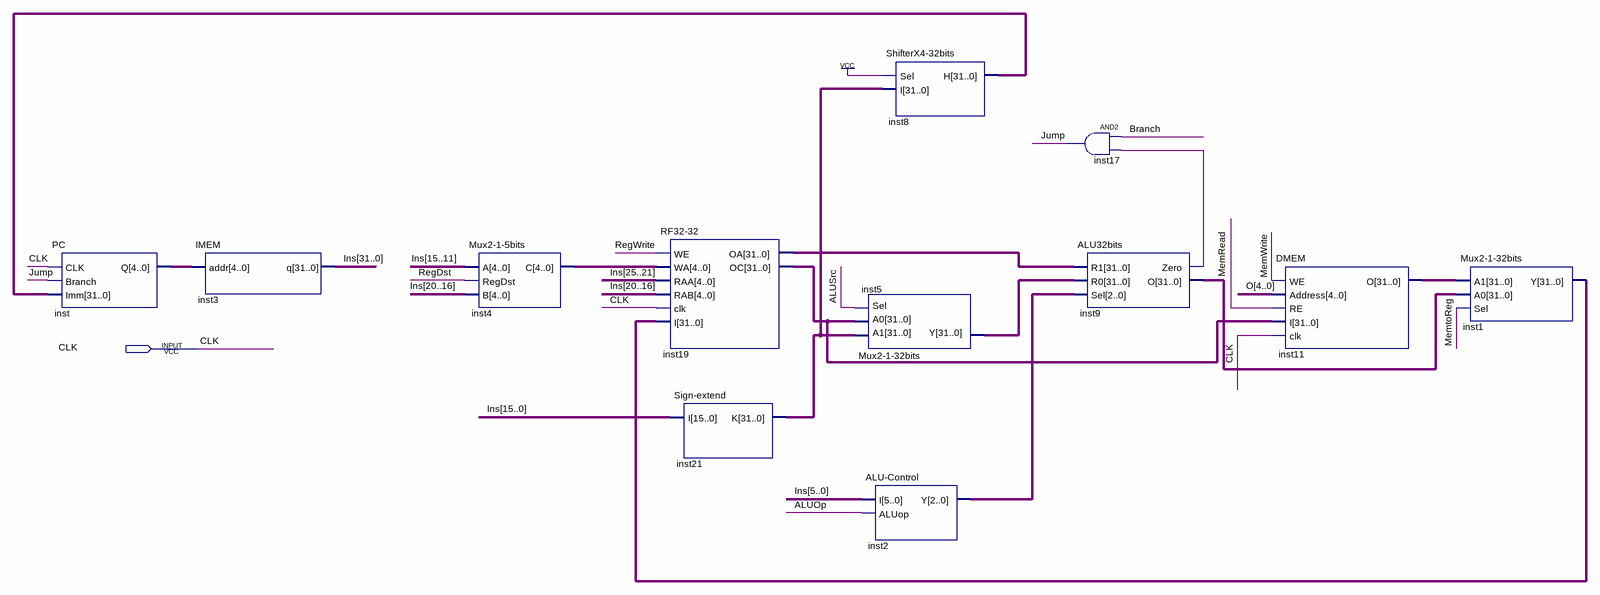
[diagram p0: schematic sheet]
// Quartus schematic Lab06-TH.bdf as structural Verilog: 12 symbols, 1 pins
module \Lab06-TH  (
  input  CLK
);

  wire ALUOp, ALUSrc, Branch, inst9_zero, Jump, MemRead, MemtoReg, MemWrite, RegDst, RegWrite;
  wire [2:0] inst2_y;
  wire [4:0] inst4_c, inst_q, O;
  wire [31:0] Ins, inst1_y, inst5_y, inst8_h, inst9_o, inst11_o, inst19_oa, inst19_oc, inst21_k;

  PC inst (.CLK(CLK), .Branch(Jump), .Imm(inst8_h), .Q(inst_q));
  IMEM inst3 (.addr(inst_q), .q(Ins));
  \Mux2-1-5bits  inst4 (.A(Ins[15:11]), .RegDst(RegDst), .B(Ins[20:16]), .C(inst4_c));
  \RF32-32  inst19 (
    .WE(RegWrite), .WA(inst4_c), .RAA(Ins[25:21]), .RAB(Ins[20:16]), .clk(CLK), .I(inst1_y), .OA(inst19_oa),
    .OC(inst19_oc));
  \Sign-extend  inst21 (.I(Ins[15:0]), .K(inst21_k));
  \Mux2-1-32bits  inst5 (.A1(inst21_k), .A0(inst19_oc), .Sel(ALUSrc), .Y(inst5_y));
  \ShifterX4-32bits  inst8 (.Sel(1'b1), .I(inst21_k), .H(inst8_h));
  \ALU-Control  inst2 (.I(Ins[5:0]), .ALUop(ALUOp), .Y(inst2_y));
  and inst17 (Jump, Branch, inst9_zero);
  ALU32bits inst9 (.R1(inst19_oa), .R0(inst5_y), .Sel(inst2_y), .Zero(inst9_zero), .O(inst9_o));
  DMEM inst11 (.WE(MemWrite), .Address(O), .RE(MemRead), .I(inst19_oc), .clk(CLK), .O(inst11_o));
  \Mux2-1-32bits  inst1 (.A1(inst11_o), .A0(inst9_o), .Sel(MemtoReg), .Y(inst1_y));
endmodule
